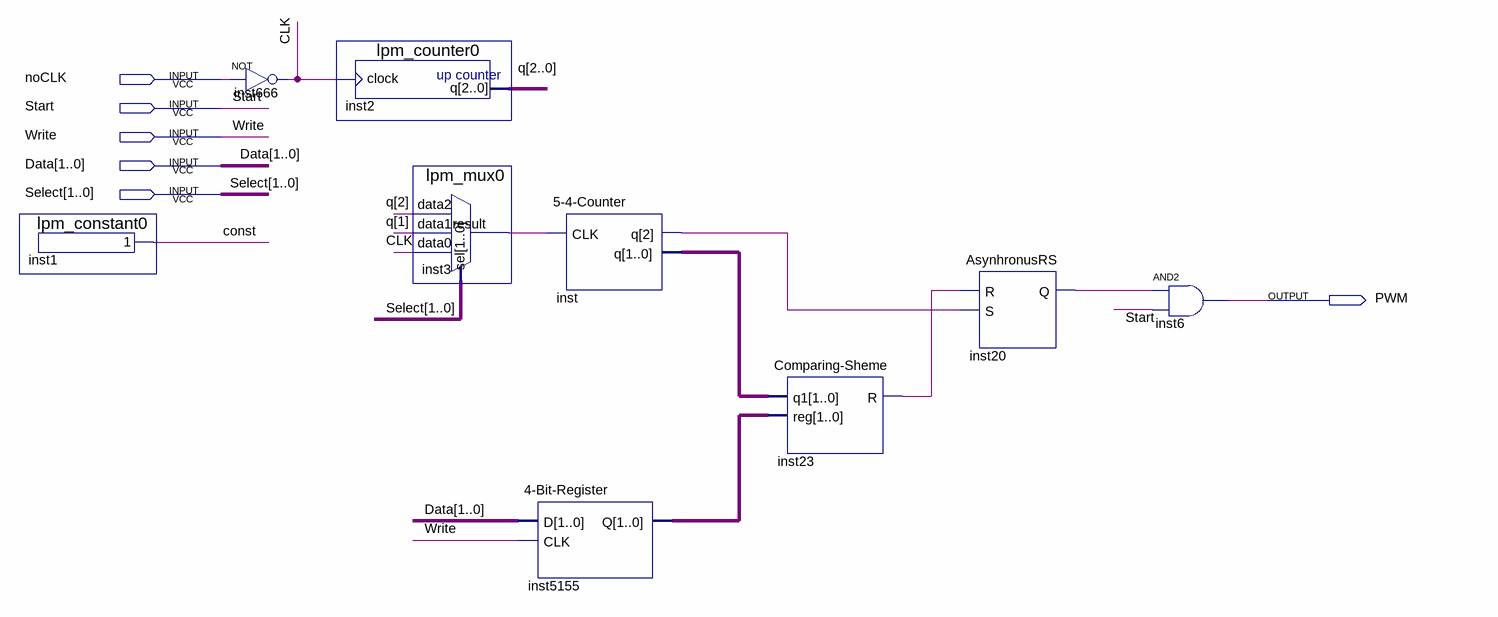
[diagram p0: schematic sheet]
// Quartus schematic Converter-4-Bit-Parallel-Code-To-PWM.bdf as structural Verilog: 9 symbols, 6 pins
module \Converter-4-Bit-Parallel-Code-To-PWM  (
  input  noCLK,
  input  Start,
  input  Write,
  input  [1:0] Data,
  input  [1:0] Select,
  output PWM
);

  wire CLK, \const , inst3_result, inst20_q, inst23_r, inst_q_2;
  wire [1:0] inst5155_q, inst_q;
  wire [2:0] q;

  lpm_constant0 inst1 (.result(\const ));
  not inst666 (CLK, noCLK);
  lpm_counter0 inst2 (.clock(CLK), .q(q));
  lpm_mux0 inst3 (.data2(q[2]), .data1(q[1]), .data0(CLK), .sel(Select), .result(inst3_result));
  \5-4-Counter  inst (.CLK(inst3_result), .q({inst_q_2, inst_q}));
  \4-Bit-Register  inst5155 (.D(Data), .CLK(Write), .Q(inst5155_q));
  \Comparing-Sheme  inst23 (.q1(inst_q), .\reg (inst5155_q), .R(inst23_r));
  AsynhronusRS inst20 (.R(inst23_r), .S(inst_q_2), .Q(inst20_q));
  and inst6 (PWM, inst20_q, Start);
endmodule
